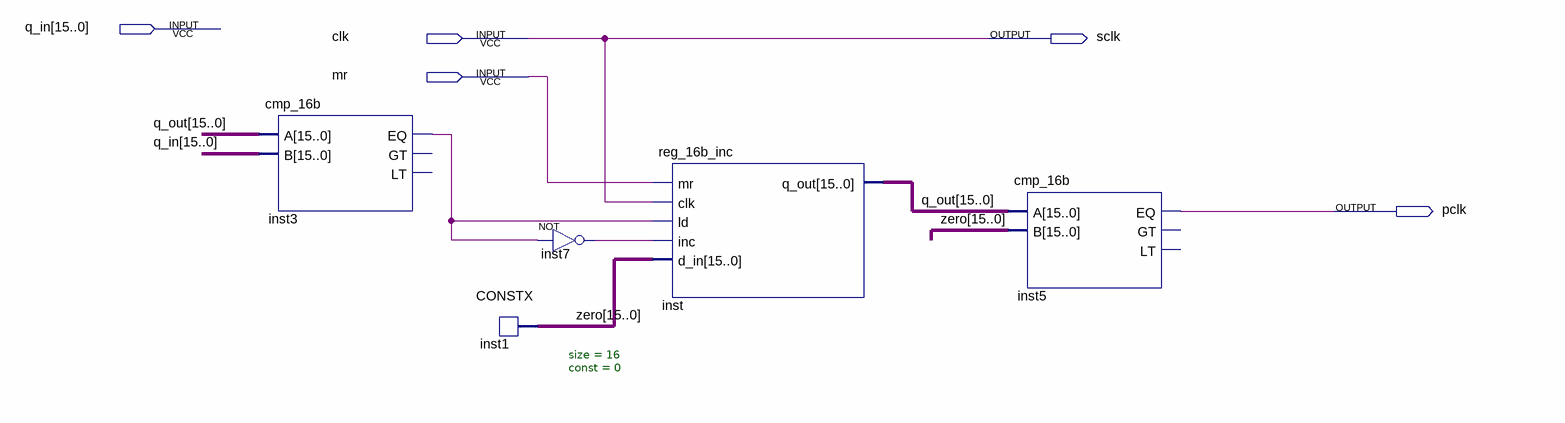
[diagram p0: schematic sheet]
// Quartus schematic PLL_16b.bdf as structural Verilog: 5 symbols, 5 pins
module PLL_16b (
  input  [15:0] q_in,
  input  clk,
  input  mr,
  output sclk,
  output pclk
);

  wire inst3_eq, inst7_out;
  wire [15:0] q_out, zero;

  cmp_16b inst3 (.A(q_out), .B(q_in), .EQ(inst3_eq));  // open: GT, LT
  CONSTX #(.size(16), .\const (0)) inst1 (.data(zero));
  not inst7 (inst7_out, inst3_eq);
  reg_16b_inc inst (.mr(mr), .clk(clk), .ld(inst3_eq), .inc(inst7_out), .d_in(zero), .q_out(q_out));
  cmp_16b inst5 (.A(q_out), .B(zero), .EQ(pclk));  // open: GT, LT

  assign sclk = clk;
endmodule
